# Altium schematic sheet Sheet1_Auto_sedzia.SchDoc
size A2; SheetNumber: 1; SheetTotal: 1
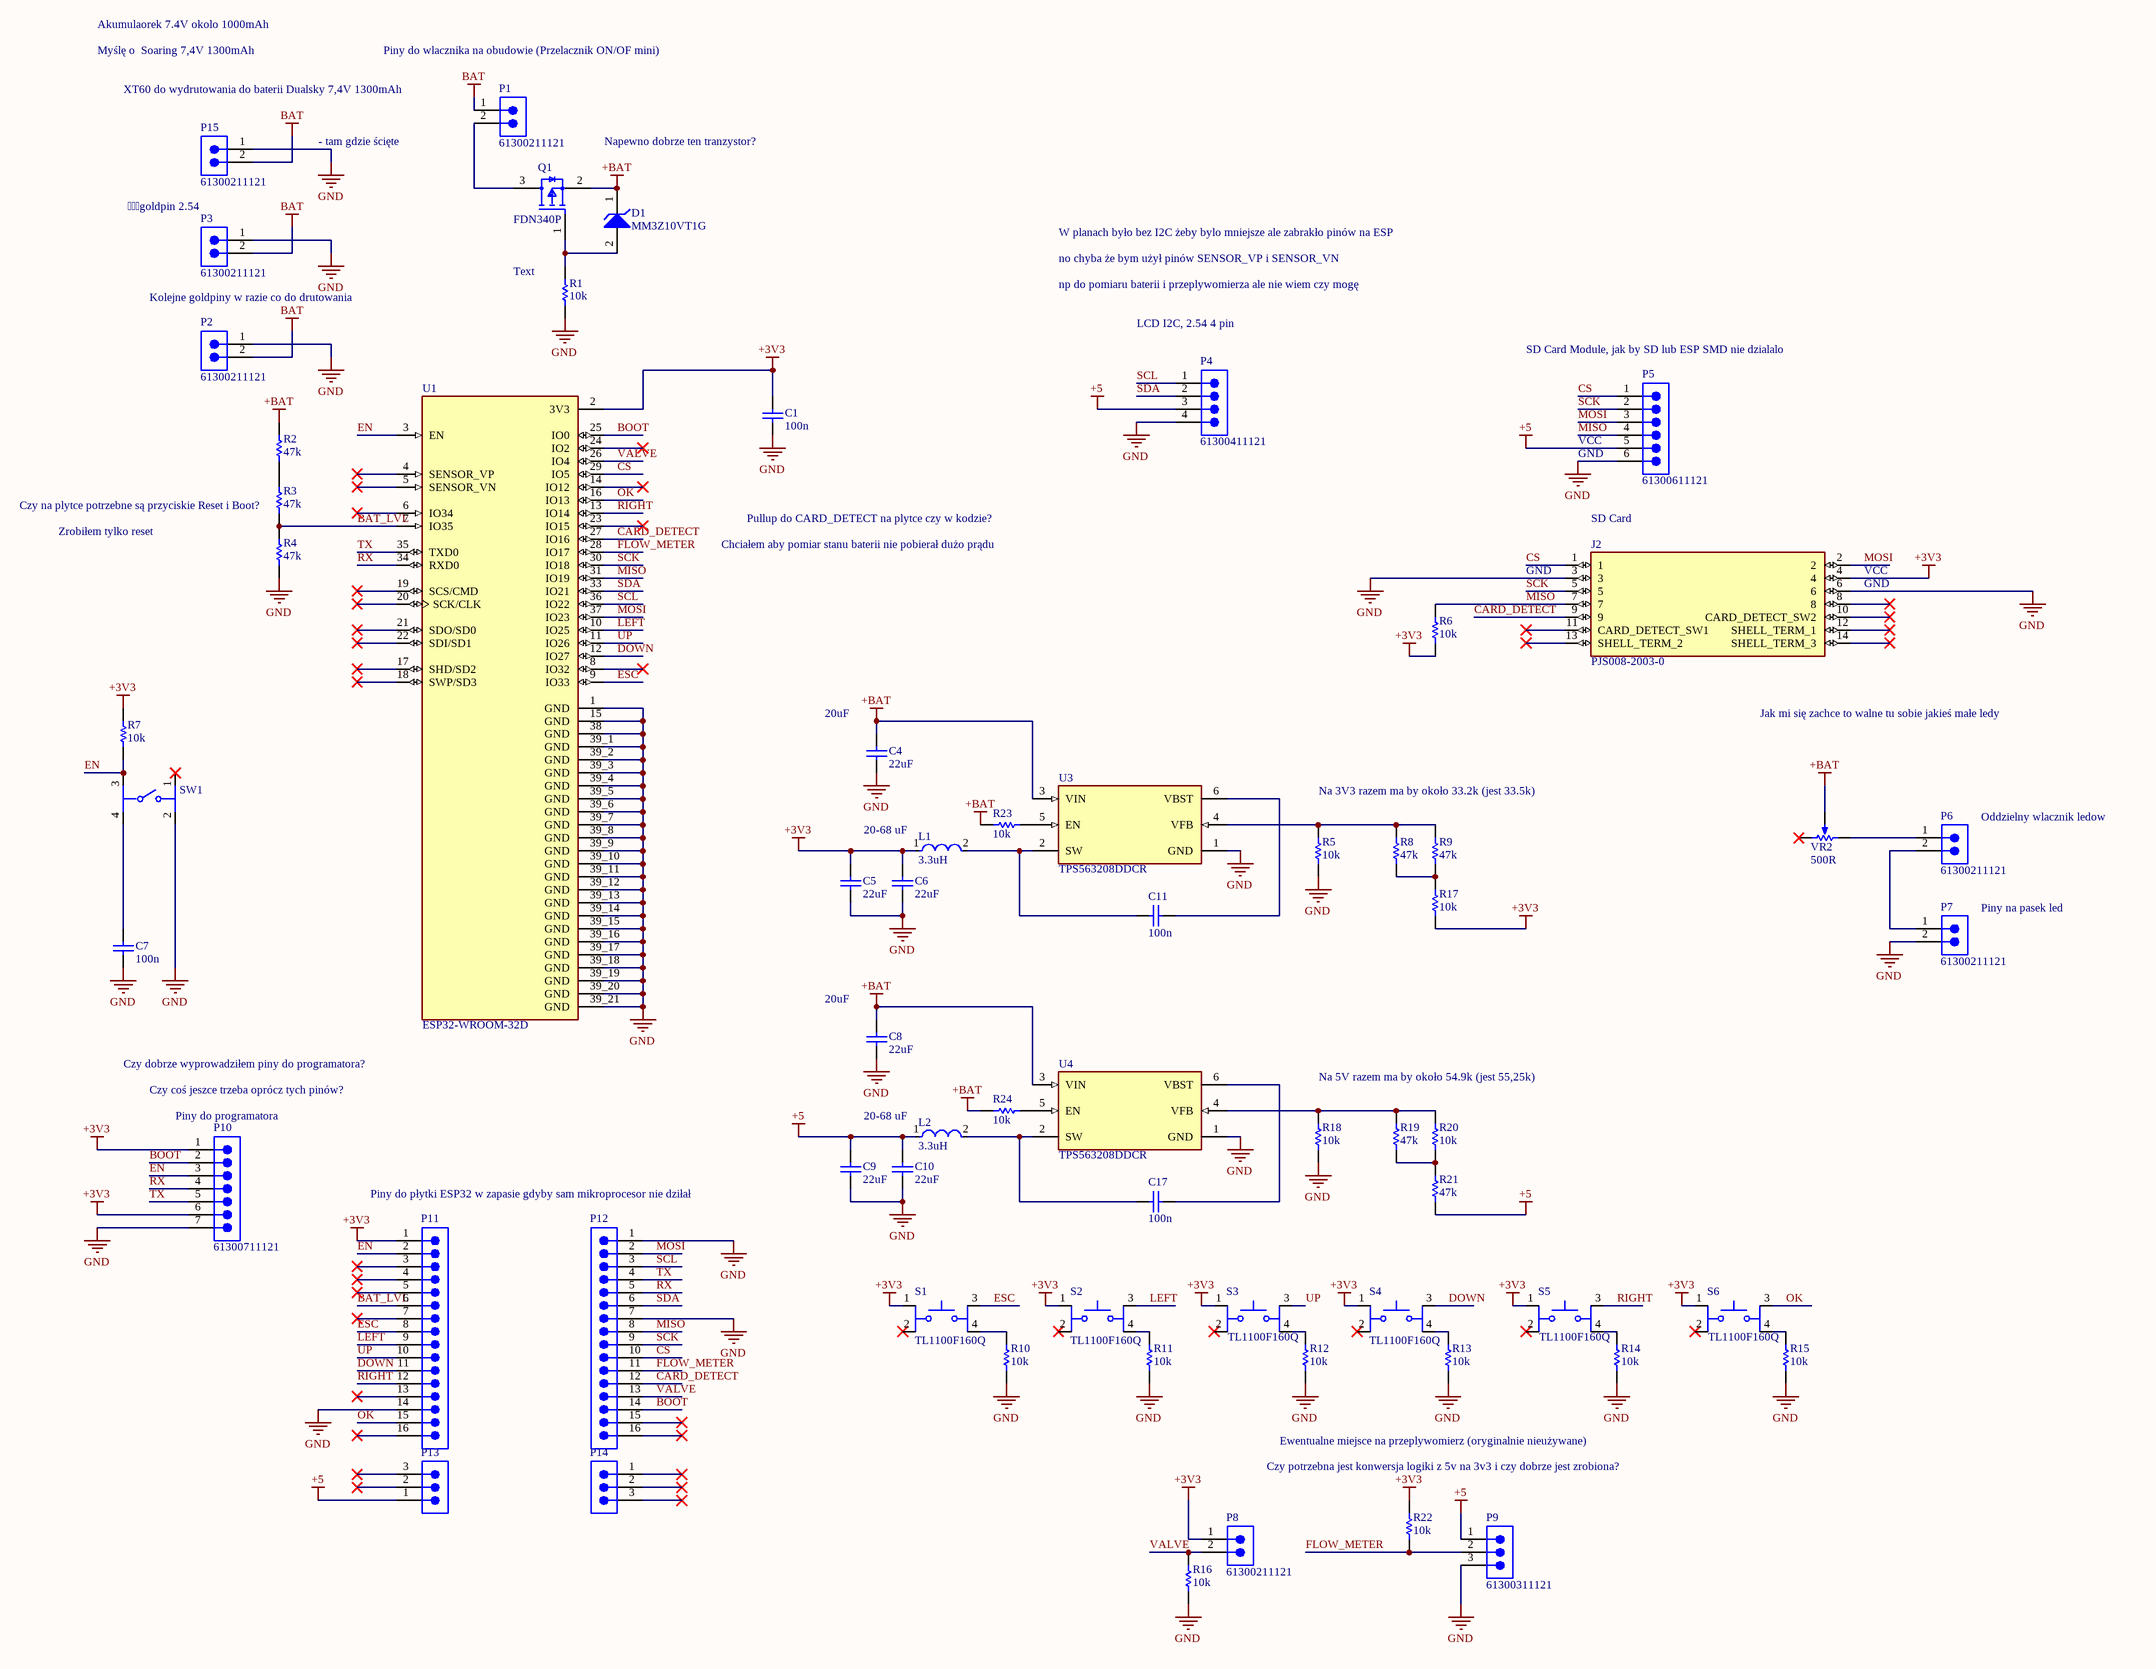
[diagram p0: Sheet1_Auto_sedzia.SchDoc]

## Parts
C1  100n  [CAPC2013X88X50LL20T25]
C4  22uF  [CAPC1608X100X20ML10]
C5  22uF  [CAPC1608X100X20ML10]
C6  22uF  [CAPC1608X100X20ML10]
C7  100n  [CAPC2013X88X50LL20T25]
C8  22uF  [CAPC1608X100X20ML10]
C9  22uF  [CAPC1608X100X20ML10]
C10  22uF  [CAPC1608X100X20ML10]
C11  100n  [CAPC2013X88X50LL20T25]
C17  100n  [CAPC2013X88X50LL20T25]
D1  MM3Z10VT1G  [ONSC-SOD-323-2-477-02_V]
J2  PJS008-2003-0  [PJS008-2003-0]
L1  3.3uH  [FP-SRN6045-MFG]
L2  3.3uH  [FP-SRN6045-MFG]
P1  61300211121  [61300211121]
P2  61300211121  [61300211121]
P3  61300211121  [61300211121]
P4  61300411121  [61300411121]
P5  61300611121  [61300611121]
P6  61300211121  [61300211121]
P7  61300211121  [61300211121]
P8  61300211121  [61300211121]
P9  61300311121  [61300311121]
P10  61300711121  [61300711121]
P11  61301611121  [61301611121]  (value not drawn)
P12  61301611121  [61301611121]  (value not drawn)
P13  TSW-103-07-G-S  [SMTC-TSW-103-07-X-S]  (value not drawn)
P14  TSW-103-07-G-S  [SMTC-TSW-103-07-X-S]  (value not drawn)
P15  61300211121  [61300211121]
Q1  FDN340P  [FP-527AG-MFG]
R1  10k  [RESC0805(2012)_L]
R2  47k  [RESC0805(2012)_L]
R3  47k  [RESC0805(2012)_L]
R4  47k  [RESC0805(2012)_L]
R5  10k  [RESC0805(2012)_L]
R6  10k  [RESC0805(2012)_L]
R7  10k  [RESC0805(2012)_L]
R8  47k  [RESC0805(2012)_L]
R9  47k  [RESC0805(2012)_L]
R10  10k  [RESC0805(2012)_L]
R11  10k  [RESC0805(2012)_L]
R12  10k  [RESC0805(2012)_L]
R13  10k  [RESC0805(2012)_L]
R14  10k  [RESC0805(2012)_L]
R15  10k  [RESC0805(2012)_L]
R16  10k  [RESC0805(2012)_L]
R17  10k  [RESC0805(2012)_L]
R18  10k  [RESC0805(2012)_L]
R19  47k  [RESC0805(2012)_L]
R20  10k  [RESC0805(2012)_L]
R21  47k  [RESC0805(2012)_L]
R22  10k  [RESC0805(2012)_L]
R23  10k  [RESC0805(2012)_L]
R24  10k  [RESC0805(2012)_L]
S1  TL1100F160Q  [SW_TL1100F160Q]
S2  TL1100F160Q  [SW_TL1100F160Q]
S3  TL1100F160Q  [SW_TL1100F160Q]
S4  TL1100F160Q  [SW_TL1100F160Q]
S5  TL1100F160Q  [SW_TL1100F160Q]
S6  TL1100F160Q  [SW_TL1100F160Q]
SW1  PTS645SM43SMTR92LFS  [FP-PTS645SM43SMTR92LFS-MFG]  (value not drawn)
U1  ESP32-WROOM-32D  [MODULE_ESP32-WROOM-32D]
U3  TPS563208DDCR  [FP-DDC0006A-MFG]
U4  TPS563208DDCR  [FP-DDC0006A-MFG]
VR2  500R  [BOUR-3362P]

## Nets
+3V3: C1.2 C5.2 C6.2 J2.4 L1.1 P8.1 P10.1 P10.6 P11.1 R6.1 R7.2 R17.1 R22.2 S1.1 S2.1 S3.1 S4.1 S5.1 S6.1 U1.2(3V3)
+5: C9.2 C10.2 L2.1 P4.3 P5.5 P9.1 P13.1 R21.1
+BAT: C4.2 C8.2 D1.1(K) Q1.2(S) R2.2 R23.2 R24.2 U3.3(VIN) U4.3(VIN) VR2.2(S)
BAT: P1.1 P2.2 P3.2 P15.2
GND: C1.1 C4.1 C5.1 C6.1 C7.1 C8.1 C9.1 C10.1 J2.3 J2.6 P2.1 P3.1 P4.4 P5.6 P7.2 P9.3 P10.7 P11.14 P12.1 P12.7 P15.1 R1.1 R4.1 R5.1 R10.1 R11.1 R12.1 R13.1 R14.1 R15.1 R16.1 R18.1 SW1.2 U1.1(GND) U1.15(GND) U1.38(GND) U1.39_1(GND) U1.39_2(GND) U1.39_3(GND) U1.39_4(GND) U1.39_5(GND) U1.39_6(GND) U1.39_7(GND) U1.39_8(GND) U1.39_9(GND) U1.39_10(GND) U1.39_11(GND) U1.39_12(GND) U1.39_13(GND) U1.39_14(GND) U1.39_15(GND) U1.39_16(GND) U1.39_17(GND) U1.39_18(GND) U1.39_19(GND) U1.39_20(GND) U1.39_21(GND) U3.1(GND) U4.1(GND)
BAT_LVL: P11.6 R3.1 R4.2 U1.7(IO35)
BOOT: P10.2 P12.14 U1.25(IO0)
CARD_DETECT: J2.9 P12.12 U1.27(IO16)
CS: J2.1 P5.1 P12.10 U1.29(IO5)
DOWN: P11.11 S4.3 U1.12(IO27)
EN: P10.3 P11.2 R7.1 SW1.3 U1.3(EN)
ESC: P11.8 S1.3 U1.9(IO33)
FLOW_METER: P9.2 P12.11 R22.1 U1.28(IO17)
LEFT: P11.9 S2.3 U1.10(IO25)
MISO: J2.7 P5.4 P12.8 R6.2 U1.31(IO19)
MOSI: J2.2 P5.3 P12.2 U1.37(IO23)
OK: P11.15 S6.3 U1.16(IO13)
RIGHT: P11.12 S5.3 U1.13(IO14)
RX: P10.4 P12.5 U1.34(RXD0)
SCK: J2.5 P5.2 P12.9 U1.30(IO18)
SCL: P4.1 P12.3 U1.36(IO22)
SDA: P4.2 P12.6 U1.33(IO21)
TX: P10.5 P12.4 U1.35(TXD0)
UP: P11.10 S3.3 U1.11(IO26)
VALVE: P8.2 P12.13 R16.2 U1.26(IO4)
NetC7_2: C7.2 SW1.4
NetC11_1: C11.1 U3.6(VBST)
NetC11_2: C11.2 L1.2 U3.2(SW)
NetC17_1: C17.1 U4.6(VBST)
NetC17_2: C17.2 L2.2 U4.2(SW)
NetD1_2: D1.2(A) Q1.1(G) R1.2
NetP1_2: P1.2 Q1.3(D)
NetP6_1: P6.1 VR2.1(CCW)
NetP6_2: P6.2 P7.1
NetR2_1: R2.1 R3.2
NetR5_2: R5.2 R8.2 R9.2 U3.4(VFB)
NetR8_1: R8.1 R9.1 R17.2
NetR10_2: R10.2 S1.4
NetR11_2: R11.2 S2.4
NetR12_2: R12.2 S3.4
NetR13_2: R13.2 S4.4
NetR14_2: R14.2 S5.4
NetR15_2: R15.2 S6.4
NetR18_2: R18.2 R19.2 R20.2 U4.4(VFB)
NetR19_1: R19.1 R20.1 R21.2
NetR23_1: R23.1 U3.5(EN)
NetR24_1: R24.1 U4.5(EN)

Not connected (* = marked no-connect by the designer): J2 8* 10(CARD_DETECT_SW2)* 11(CARD_DETECT_SW1)* 12(SHELL_TERM_1)* 13(SHELL_TERM_2)* 14(SHELL_TERM_3)*; P11 3* 4* 5* 7* 13* 16*; P12 15* 16*; P13 2* 3*; P14 1* 2* 3*; S1 2*; S2 2*; S3 2*; S4 2*; S5 2*; S6 2*; SW1 1*; U1 4(SENSOR_VP)* 5(SENSOR_VN)* 6(IO34)* 8(IO32)* 14(IO12)* 17(SHD/SD2)* 18(SWP/SD3)* 19(SCS/CMD)* 20(SCK/CLK)* 21(SDO/SD0)* 22(SDI/SD1)* 23(IO15)* 24(IO2)*; VR2 3(CW)*

## Notes on the sheet
- Akumulaorek 7.4V okolo 1000mAh
- Myślę o  Soaring 7,4V 1300mAh
- Piny do wlacznika na obudowie (Przelacznik ON/OF mini)
- XT60 do wydrutowania do baterii Dualsky 7,4V 1300mAh
- - tam gdzie ścięte
- Napewno dobrze ten tranzystor?
- goldpin 2.54
- W planach było bez I2C żeby bylo mniejsze ale zabrakło pinów na ESP
- no chyba że bym użył pinów SENSOR_VP i SENSOR_VN
- Kolejne goldpiny w razie co do drutowania
- (near R1) Text
- np do pomiaru baterii i przeplywomierza ale nie wiem czy mogę
- LCD I2C, 2.54 4 pin
- (near P5) SD Card Module, jak by SD lub ESP SMD nie dzialalo
- (near P5) VCC
- (near P5) GND
- (near R3) Czy na plytce potrzebne są przyciskie Reset i Boot?
- Pullup do CARD_DETECT na plytce czy w kodzie?
- SD Card
- Zrobiłem tylko reset
- Chciałem aby pomiar stanu baterii nie pobierał dużo prądu
- (near J2) GND
- (near J2) VCC
- (near C4) 20uF
- Jak mi się zachce to walne tu sobie jakieś małe ledy
- (near L1) 20-68 uF
- Na 3V3 razem ma by około 33.2k (jest 33.5k)
- (near P6) Oddzielny wlacznik ledow
- Piny na pasek led
- (near C8) 20uF
- Czy dobrze wyprowadziłem piny do programatora?
- Czy coś jeszce trzeba oprócz tych pinów?
- Na 5V razem ma by około 54.9k (jest 55,25k)
- (near P10) Piny do programatora
- (near L2) 20-68 uF
- Piny do płytki ESP32 w zapasie gdyby sam mikroprocesor nie dziłał
- (near R22) Czy potrzebna jest konwersja logiki z 5v na 3v3 i czy dobrze jest zrobiona?
- Ewentualne miejsce na przeplywomierz (oryginalnie nieużywane)

## Library data of the parts
C1 C7 C11 C17 = CMP-2007-00266-1: 0805; Manufacturer: Kemet; Part Number: C0805C103K5RACTU
C4-C6 C8-C10 = CMP-2000-05440-1: Chip Capacitor, 22 uF, +/- 20%, 6.3 V, -55 to 85 degC, 1608 (0603 Metric), RoHS, Tape and Reel; PCN Part Number: MLCCPartNumberChange30/Nov/2012; Manufacturer: TDK; Temperature Coefficient: X5R; Product Training Modules: CSeriesGeneralApplicationsSEAT,CCV,andTVCLDesignToolsGuidetoReplacinganElectrolyticCapacitorwithanMLCC; Other Names: 445-8028-1; Capacitance: 22µF; Voltage - Rated: 6.3V; Design Resources: 20WNon-IsolatedBuckLEDDriverUsingPLLNK460KG; Online Catalog: CSeries,GeneralPurpose; Kits: 445-9003-KIT-ND-KITCAPCERHICAPMLCCSMD; Tolerance: ±20%; Series: C; Thickness (Max): 0.039"(1.00mm); Mounting Type: SurfaceMount,MLCC; Ratings: -; Datasheet Version: Mar-15; Package Reference: 603; Packaging: CutTape(CT); Features: -; Package / Case: 0603(1608Metric); Family: CeramicCapacitors; Lead Spacing: -; RoHS Information: RoHSCertificate-MLCC; Manufacturer URL: http://www.tdk.com/; Lead Style: -; Category: Capacitors; Applications: GeneralPurpose; Package Description: 2-Pin Surface Mount Device, Body 1.6 x 0.8 mm; Standard Package: 1; Datasheet URL: http://www.farnell.com/datasheets/1913358.pdf; Height - Seated (Max): -; Operating Temperature: -55degC~85degC; Size / Dimension: 0.063"Lx0.031"W(1.60mmx0.80mm)
D1 = CMP-1060-00715-1: Zener Voltage Regulator, 300 mW, 2-Pin SOD-323, Pb-Free, Tape and Reel; Manufacturer: On Semiconductor; VZ Typ (V): 10; P Max (W): 0.3; ComponentLink1Description: Manufacturer URL; DatasheetVersion: Rev. 9; PartNumber: MM3Z10VT1G; PackageDescription: 2-Pin SOD, Body 1.7 x 1.25 mm; Packing: Tape and Reel; ComponentLink1URL: http://www.onsemi.com/; PackageReference: SOD-323-2-477-02; PackageVersion: Rev. H, 03/2007; ComponentLink3URL: http://www.onsemi.com/pub_link/Collateral/477-02.PDF.1; Mounting Technology: Surface Mount; RoHS: Pb-Free; ComponentLink2URL: http://www.onsemi.cn/pub_link/Collateral/MM3Z2V4T1-D.PDF; ComponentLink3Description: Package Specification; ComponentLink2Description: Datasheet
J2 = PJS008-2003-0: Memory Card Connectors MicroSD Crd Conn SMT Revrs Mnt Push-Push; MF: Yamaichi Electronics; SnapEDA_Link: https://www.snapeda.com/parts/PJS008-2003-0/ICH/view-part/?ref=snap; Package: None; Value: *; MP: PJS008-2003-0; Check_prices: https://www.snapeda.com/parts/PJS008-2003-0/ICH/view-part/?ref=eda
L1 L2 = CMP-07248-000070-1: FIXED IND 47UH 1.1A 257 MOHM SMD; Inductance Tolerance: 30%; Core Material: Ferrite; DC Resistance (DCR): 257mR; Self Resonant Frequency: 7MHz; Saturation Current: 1.3A; Tolerance: 20%; Shielding: Shielded; Test Frequency: 100kHz; Max Operating Temperature: 125°C; Termination: SMD/SMT; Inductance: 47uH; Number of Pins: 2; RMS Current (Irms): 1.1A; Height: 4.5mm; Depth: 6.2mm; DC Current: 1.1A; Series: SRN6045; RoHS Compliant: Yes; Max DC Current: 1.1A; Case/Package: Nonstandard; Height - Seated (Max): 0.177inch; Mount: Surface Mount; Military Standard: Not; Package Quantity: 1000; Packaging: Tape and Reel; Current Rating: 1.1A; Min Operating Temperature: -40°C; Width: 0.236inch; Resistor Type: Wirewound; Length: 6mm; REACH SVHC: No SVHC
P1-P3 P6-P8 P15 = CMP-1712-00002-5: NexarPartId: 20081794; Operating Supply Voltage: 250V; Current Rating: 3A; Gender: Male; Number of Contacts: 2; Pitch: 2.54mm; Connector Type: Male Pin; Contact Resistance: 20mΩ; Contact Plating: Gold; Contact Material: Copper; Number of Pins: 2; Min Operating Temperature: -40°C; Packaging: Bulk; Lead Pitch: 2.54mm; Mount: Through Hole; Orientation: Vertical; RoHS: Compliant; REACH SVHC: No SVHC; Height: 8.94mm; Termination: Through Hole; Number of Positions: 2; Contact Mating Length: 5.9944mm; Color: Black; Contact Gender: Male; Number of Rows: 1; Housing Material: PBT; Lead Free: Lead Free; Voltage Rating: 250V; Max Operating Temperature: 125°C
P4 = CMP-1502-01064-2: NexarPartId: 32855522; Pitch: 2.54mm; Number of Contacts: 4; Contact Resistance: 20mΩ; Gender: Male; Current Rating: 3A; Connector Type: Male Pin; Voltage Rating: 250V; Lead Free: Lead Free; Contact Plating: Gold; Max Operating Temperature: 105°C; Packaging: Bulk; Height: 8.89mm; Orientation: Vertical; Contact Mating Length: 5.9944mm; Contact Material: Copper; Lead Pitch: 2.54mm; Min Operating Temperature: -40°C; Termination: Solder; Color: Black; Number of Rows: 1; REACH SVHC: Unknown; RoHS: Compliant; Mount: Through Hole; Number of Positions: 4; Number of Pins: 4; Operating Supply Voltage: 250V
P5 = CMP-1502-01070-2: NexarPartId: 20084590; Operating Supply Voltage: 250V; Current Rating: 3A; Number of Contacts: 6; Gender: Male; Connector Type: Male Pin; Pitch: 2.54mm; Contact Resistance: 20mΩ; Lead Free: Lead Free; REACH SVHC: Unknown; Number of Rows: 1; Color: Black; Min Operating Temperature: -40°C; Contact Material: Copper; Lead Pitch: 2.54mm; Contact Plating: Gold; Number of Pins: 6; Height: 8.89mm; Orientation: Vertical; Termination: Through Hole; Mount: Through Hole; RoHS: Compliant; Contact Gender: Male; Contact Mating Length: 5.9944mm; Voltage Rating: 250V; Number of Positions: 6; Housing Material: PBT; Packaging: Bulk; Max Operating Temperature: 105°C
P9 = CMP-1502-01062-2: NexarPartId: 32855521; Voltage Rating: 250V; Current Rating: 3A; Connector Type: Male Pin; Number of Positions: 3; Gender: Male; Contact Resistance: 20mΩ; Pitch: 2.54mm; Max Operating Temperature: 105°C; Lead Pitch: 2.54mm; Lead Free: Lead Free; Contact Mating Length: 5.9944mm; Contact Material: Copper; Number of Pins: 3; Orientation: Vertical; Height: 8.94mm; Packaging: Bulk; Min Operating Temperature: -40°C; Mount: Through Hole; RoHS: Compliant; Number of Contacts: 3; Operating Supply Voltage: 250V; Termination: Solder; Number of Rows: 1; Contact Plating: Gold; Color: Black; REACH SVHC: Unknown
P10 = CMP-1502-01074-2: NexarPartId: 32855531; Pitch: 2.54mm; Connector Type: Male Pin; Gender: Male; Current Rating: 3A; Contact Resistance: 20mΩ; Operating Supply Voltage: 250V; Number of Contacts: 7; REACH SVHC: Unknown; Termination: Solder; Contact Plating: Gold; Lead Pitch: 2.54mm; Contact Mating Length: 5.9944mm; RoHS: Compliant; Packaging: Bulk; Mount: Through Hole; Color: Black; Number of Pins: 7; Contact Material: Copper; Number of Rows: 1; Orientation: Vertical; Number of Positions: 7
P11 P12 = CMP-1502-01095-3: NexarPartId: 32855548; Pitch: 2.54mm; Current Rating: 3A; Connector Type: Male Pin; Number of Contacts: 16; Operating Supply Voltage: 250V; Gender: Male; Contact Resistance: 20mΩ; Height: 8.89mm; Contact Mating Length: 5.9944mm; Lead Pitch: 2.54mm; Max Operating Temperature: 105°C; Contact Material: Copper; Orientation: Vertical; Mount: Through Hole; Packaging: Bulk; REACH SVHC: Unknown; RoHS: Compliant; Voltage Rating: 250V; Termination: Solder; Number of Pins: 16; Min Operating Temperature: -40°C; Color: Black; Number of Rows: 1; Number of Positions: 16; Contact Plating: Gold
P13 P14 = CMP-1024-00333-1: 0.025" SQ Post Header, Through-hole, Vertical, -55 to 125 degC, 2.54 mm Pitch, 3-Pin, Male, RoHS; Manufacturer: Samtec; Pitch: 2.54 mm; ComponentLink3URL: http://www.samtec.com/documents/webfiles/cpdf/TSW-XXX-XX-XXX-X-XX-XXX-MKT.pdf; Temperature Range: -55 to 125 degC; DatasheetVersion: F-214; ComponentLink1Description: Manufacturer URL; ComponentLink2URL: http://www.samtec.com/documents/webfiles/pdf/TSW_TH.PDF; RoHS: True; Orientation: Vertical; ComponentLink2Description: Datasheet; ComponentLink3Description: Package Specification; PackageDescription: .025[0.64] SQ. Post Terminal Strip Assembly; Mounting Technology: Through-hole; PackageVersion: DM, 8/1988; ComponentLink1URL: http://www.samtec.com; PackageReference: TSW-103-07-X-S; PartNumber: TSW-103-07-G-S
Q1 = CMP-2100-03638-2: MOSFET P-CH 20V 2A SSOT3; Fall Time: 11ns; Rise Time: 9ns; Voltage Rating (DC): -20V; Power Dissipation: 500mW; Nominal Vgs: -800mV; Current Rating: -2A; Gate to Source Voltage (Vgs): 8V; Rds On Max: 70mR; Turn-Off Delay Time: 27ns; Element Configuration: Single; Number of Elements: 1; Input Capacitance: 779pF; Drain to Source Resistance: 60mR; Turn-On Delay Time: 10ns; Package Quantity: 1; Mount: Surface Mount; Case/Package: SOT-23; Min Operating Temperature: -55°C; REACH SVHC: No SVHC; Weight: 0.03g; Packaging: Tape and Reel; Threshold Voltage: -800mV; Max Operating Temperature: 150°C; Dual Supply Voltage: -20V; Termination: SMD/SMT; Drain to Source Voltage (Vdss): 20V; Height: 0.94mm; Length: 2.92mm; Contact Plating: Tin; Width: 3.05mm; Drain to Source Breakdown Voltage: -20V; Max Power Dissipation: 500mW; Continuous Drain Current (ID): 2A; Number of Pins: 3; Lead Free: Lead Free; Radiation Hardening: No; On-State Resistance: 70MR
R1-R24 = CMP-1013-00631-1: 10K 0.125W 1% 0805 (2012 Metric)  SMD; Case-Metric: 2012; Case-EIA: 0805; Value: 12000.00 Ohm; Technology: SMT; Tolerance: 1 %; Power: 0.125 W
SW1 = CMP-2000-05160-2: SWITCH TACTILE SPST-NO 0.05A 12V; Contact Resistance: 100mR; Throw Configuration: SPST; Illumination Type: Non-Illuminated; Mechanical Life: 100000Cycles; Current Rating: 50mA; Switch Function: Off-Mom; Actuator Length: 0.85mm; Actuator Material: Nylon; Actuator Type: Standard; Operating Force: 160gf; Min Operating Temperature: -20°C; REACH SVHC: No SVHC; Termination: Gull Wing; Case/Package: SMD/SMT; Packaging: Tape and Reel; Mount: Surface Mount; Voltage Rating (DC): 12V; Orientation: Straight; Lead Free: Lead Free; Contact Material: Silver; Color: Black; Max Current Rating: 50mA; Contact Plating: Silver; Depth: 9mm; Package Quantity: 1; Max Voltage Rating (DC): 12V; Length: 6mm; Max Operating Temperature: 60°C
U1 = ESP32-WROOM-32D: Bluetooth, WiFi 802.11b/g/n, Bluetooth v4.2 +EDR, Class 1, 2 and 3 Transceiver Module 2.4GHz ~ 2.5GHz Integrated; MF: Espressif Systems; Price: None; Availability: In Stock; Package: Module Espressif Systems; MP: ESP32-WROOM-32D; Value: *; SnapEDA_Link: https://www.snapeda.com/parts/ESP32-WROOM-32D/Espressif+Systems/view-part/?ref=snap; Purchase-URL: https://pricing.snapeda.com/search/part/ESP32-WROOM-32D/?ref=eda; Check_prices: https://www.snapeda.com/parts/ESP32-WROOM-32D/Espressif+Systems/view-part/?ref=eda
U3 U4 = CMP-04918-000356-1: IC REG BUCK ADJ 3A TSOT23-6; Min Output Voltage: 768mV; Output Configuration: Positive; Max Output Voltage: 7V; Quiescent Current: 400uA; Max Input Voltage: 17V; Min Input Voltage: 4.5V; Synchronous Rectifier: Yes; Switching Frequency: 580kHz; Number of Outputs: 1; Output Type: Adjustable; Mount: Surface Mount; Case/Package: SOT-23-6; Min Operating Temperature: -40°C; Packaging: Tape and Reel; RoHS Compliant: Yes; Output Current: 3A; Lead Free: Lead Free; Max Operating Temperature: 125°C
VR2 = CMP-1747-00004-1: Square Trimpot(R) Trimming Potentiometer, 10 KOhm, 300 V, -55 to 125 degC, 3-Pin THD, RoHS, Tube; Voltage Rating: 220 mV; Power Rating: 1 W; Tolerance: 1%; Resistance: 50 mohm; Case/Package: 1206; Length: 3.2 mm; RoHSCompliant: True; PackageDescription: 3-Pin Through Hole Device, Body 6.6 x 6.99 mm, Pitch 2.54 mm; ComponentLink2Description: Datasheet; REACH SVHC: No SVHC; Mount: Surface Mount; Height: 0.6 mm; Packaging: Tape and Reel; ComponentLink1URL: http://www.bourns.com/; Case Code (Imperial): 0612; Pins: 2; Case Code (Metric): 1632; ComponentLink2URL: http://www.bourns.com/docs/Product-Datasheets/3362.pdf; Min Operating Temperature: -25degC; ComponentLink1Description: Manufacturer URL; PackageReference: 3326P; Max Operating Temperature: 125degC; Width: 1.6 mm; Package Quantity: 5000; DatasheetVersion: May-16
S1-S6 = TL1100F160Q: Price: None; MP: TL1100F160Q; Value: *; Availability: Unavailable; Package: None